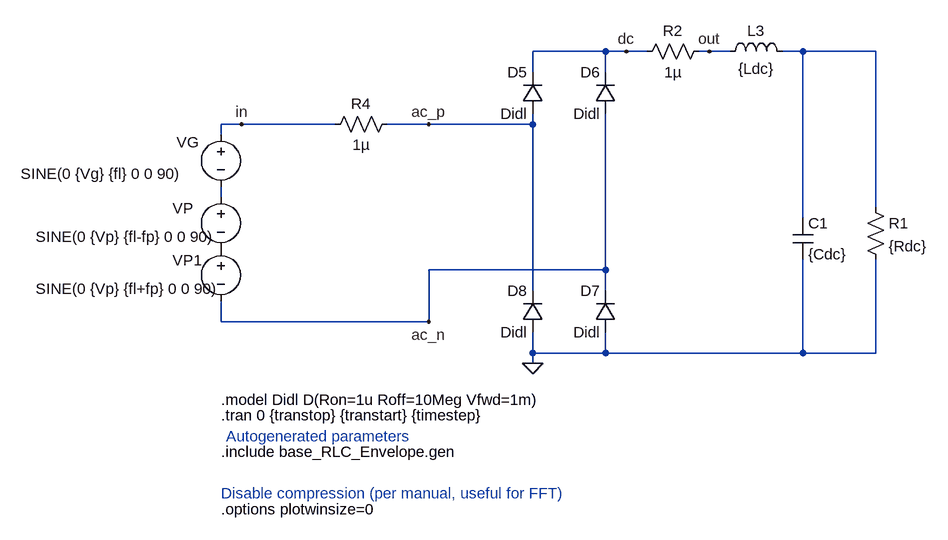
[diagram p0: schematic base_RLC_Envelope.asc]
base_RLC_Envelope.asc, the LTspice schematic file:
Version 4
SHEET 1 2640 776
WIRE 512 -480 400 -480
WIRE 544 -480 512 -480
WIRE 576 -480 544 -480
WIRE 672 -480 656 -480
WIRE 704 -480 672 -480
WIRE 816 -480 784 -480
WIRE 928 -480 816 -480
WIRE 400 -448 400 -480
WIRE 512 -448 512 -480
WIRE -48 -368 -80 -368
WIRE 96 -368 -48 -368
WIRE 240 -368 176 -368
WIRE 400 -368 400 -384
WIRE 400 -368 240 -368
WIRE -80 -352 -80 -368
WIRE -80 -256 -80 -272
WIRE 928 -240 928 -480
WIRE 816 -224 816 -480
WIRE 512 -144 512 -384
WIRE 512 -144 240 -144
WIRE 400 -112 400 -368
WIRE 512 -112 512 -144
WIRE -80 -64 -80 -96
WIRE 240 -64 240 -144
WIRE 240 -64 -80 -64
WIRE 400 -16 400 -48
WIRE 512 -16 512 -48
WIRE 512 -16 400 -16
WIRE 816 -16 816 -160
WIRE 816 -16 512 -16
WIRE 928 -16 928 -160
WIRE 928 -16 816 -16
WIRE 400 0 400 -16
FLAG 400 0 0
FLAG 544 -480 dc
FLAG 240 -368 ac_p
FLAG 240 -64 ac_n
FLAG 672 -480 out
FLAG -48 -368 in
SYMBOL res 80 -352 R270
WINDOW 0 32 56 VTop 2
WINDOW 3 0 56 VBottom 2
SYMATTR InstName R4
SYMATTR Value 1µ
SYMBOL diode 416 -384 R180
WINDOW 0 24 64 Left 2
WINDOW 3 24 0 Left 2
SYMATTR InstName D5
SYMATTR Value Didl
SYMBOL diode 528 -384 R180
WINDOW 0 24 64 Left 2
WINDOW 3 24 0 Left 2
SYMATTR InstName D6
SYMATTR Value Didl
SYMBOL diode 528 -48 R180
WINDOW 0 24 64 Left 2
WINDOW 3 24 0 Left 2
SYMATTR InstName D7
SYMATTR Value Didl
SYMBOL diode 416 -48 R180
WINDOW 0 24 64 Left 2
WINDOW 3 24 0 Left 2
SYMATTR InstName D8
SYMATTR Value Didl
SYMBOL voltage -80 -368 R0
WINDOW 123 0 0 Left 2
WINDOW 39 39 83 Left 2
WINDOW 3 -308 76 Left 2
WINDOW 0 -68 28 Left 2
SYMATTR Value SINE(0 {Vg} {fl} 0 0 90)
SYMATTR InstName VG
SYMBOL voltage -80 -272 R0
WINDOW 0 -74 33 Left 2
WINDOW 39 41 79 Left 2
WINDOW 3 -285 77 Left 2
WINDOW 123 0 0 Left 0
SYMATTR InstName VP
SYMATTR Value SINE(0 {Vp} {fl-fp} 0 0 90)
SYMBOL ind 688 -464 R270
WINDOW 0 32 56 VTop 2
WINDOW 3 5 56 VBottom 2
SYMATTR InstName L3
SYMATTR Value {Ldc}
SYMATTR SpiceLine Rser=0
SYMBOL cap 800 -224 R0
SYMATTR InstName C1
SYMATTR Value {Cdc}
SYMATTR SpiceLine Rser=1u
SYMBOL res 912 -256 R0
SYMATTR InstName R1
SYMATTR Value {Rdc}
SYMBOL res 560 -464 R270
WINDOW 0 32 56 VTop 2
WINDOW 3 0 56 VBottom 2
SYMATTR InstName R2
SYMATTR Value 1µ
SYMBOL voltage -80 -192 R0
WINDOW 0 -74 33 Left 2
WINDOW 39 41 79 Left 2
WINDOW 3 -285 77 Left 2
WINDOW 123 0 0 Left 0
SYMATTR InstName VP1
SYMATTR Value SINE(0 {Vp} {fl+fp} 0 0 90)
TEXT -80 56 Left 2 !.model Didl D(Ron=1u Roff=10Meg Vfwd=1m)
TEXT -80 136 Left 2 !.include base_RLC_Envelope.gen
TEXT -72 112 Left 2 ;Autogenerated parameters
TEXT -80 80 Left 2 !.tran 0 {transtop} {transtart} {timestep}
TEXT -80 200 Left 2 ;Disable compression (per manual, useful for FFT)
TEXT -80 224 Left 2 !.options plotwinsize=0

The netlist it stands for:
* base_RLC_Envelope.asc
R4 in ac_p 1µ
D5 ac_p dc Didl
D6 ac_n dc Didl
D7 0 ac_n Didl
D8 0 ac_p Didl
VG in N002 SINE(0 {Vg} {fl} 0 0 90)
VP N002 P001 SINE(0 {Vp} {fl-fp} 0 0 90)
L3 out N001 {Ldc} Rser=0
C1 N001 0 {Cdc} Rser=1u
R1 N001 0 {Rdc}
R2 dc out 1µ
VP1 P001 ac_n SINE(0 {Vp} {fl+fp} 0 0 90)
.model D D
.lib standard.dio
.model Didl D(Ron=1u Roff=10Meg Vfwd=1m)
.include base_RLC_Envelope.gen
* Autogenerated parameters
.tran 0 {transtop} {transtart} {timestep}
* Disable compression (per manual, useful for FFT)
.options plotwinsize=0
.backanno
.end